# Altium schematic sheet CoproMKII_Ethernet.SchDoc
size B; SheetNumber: 4; SheetTotal: 4
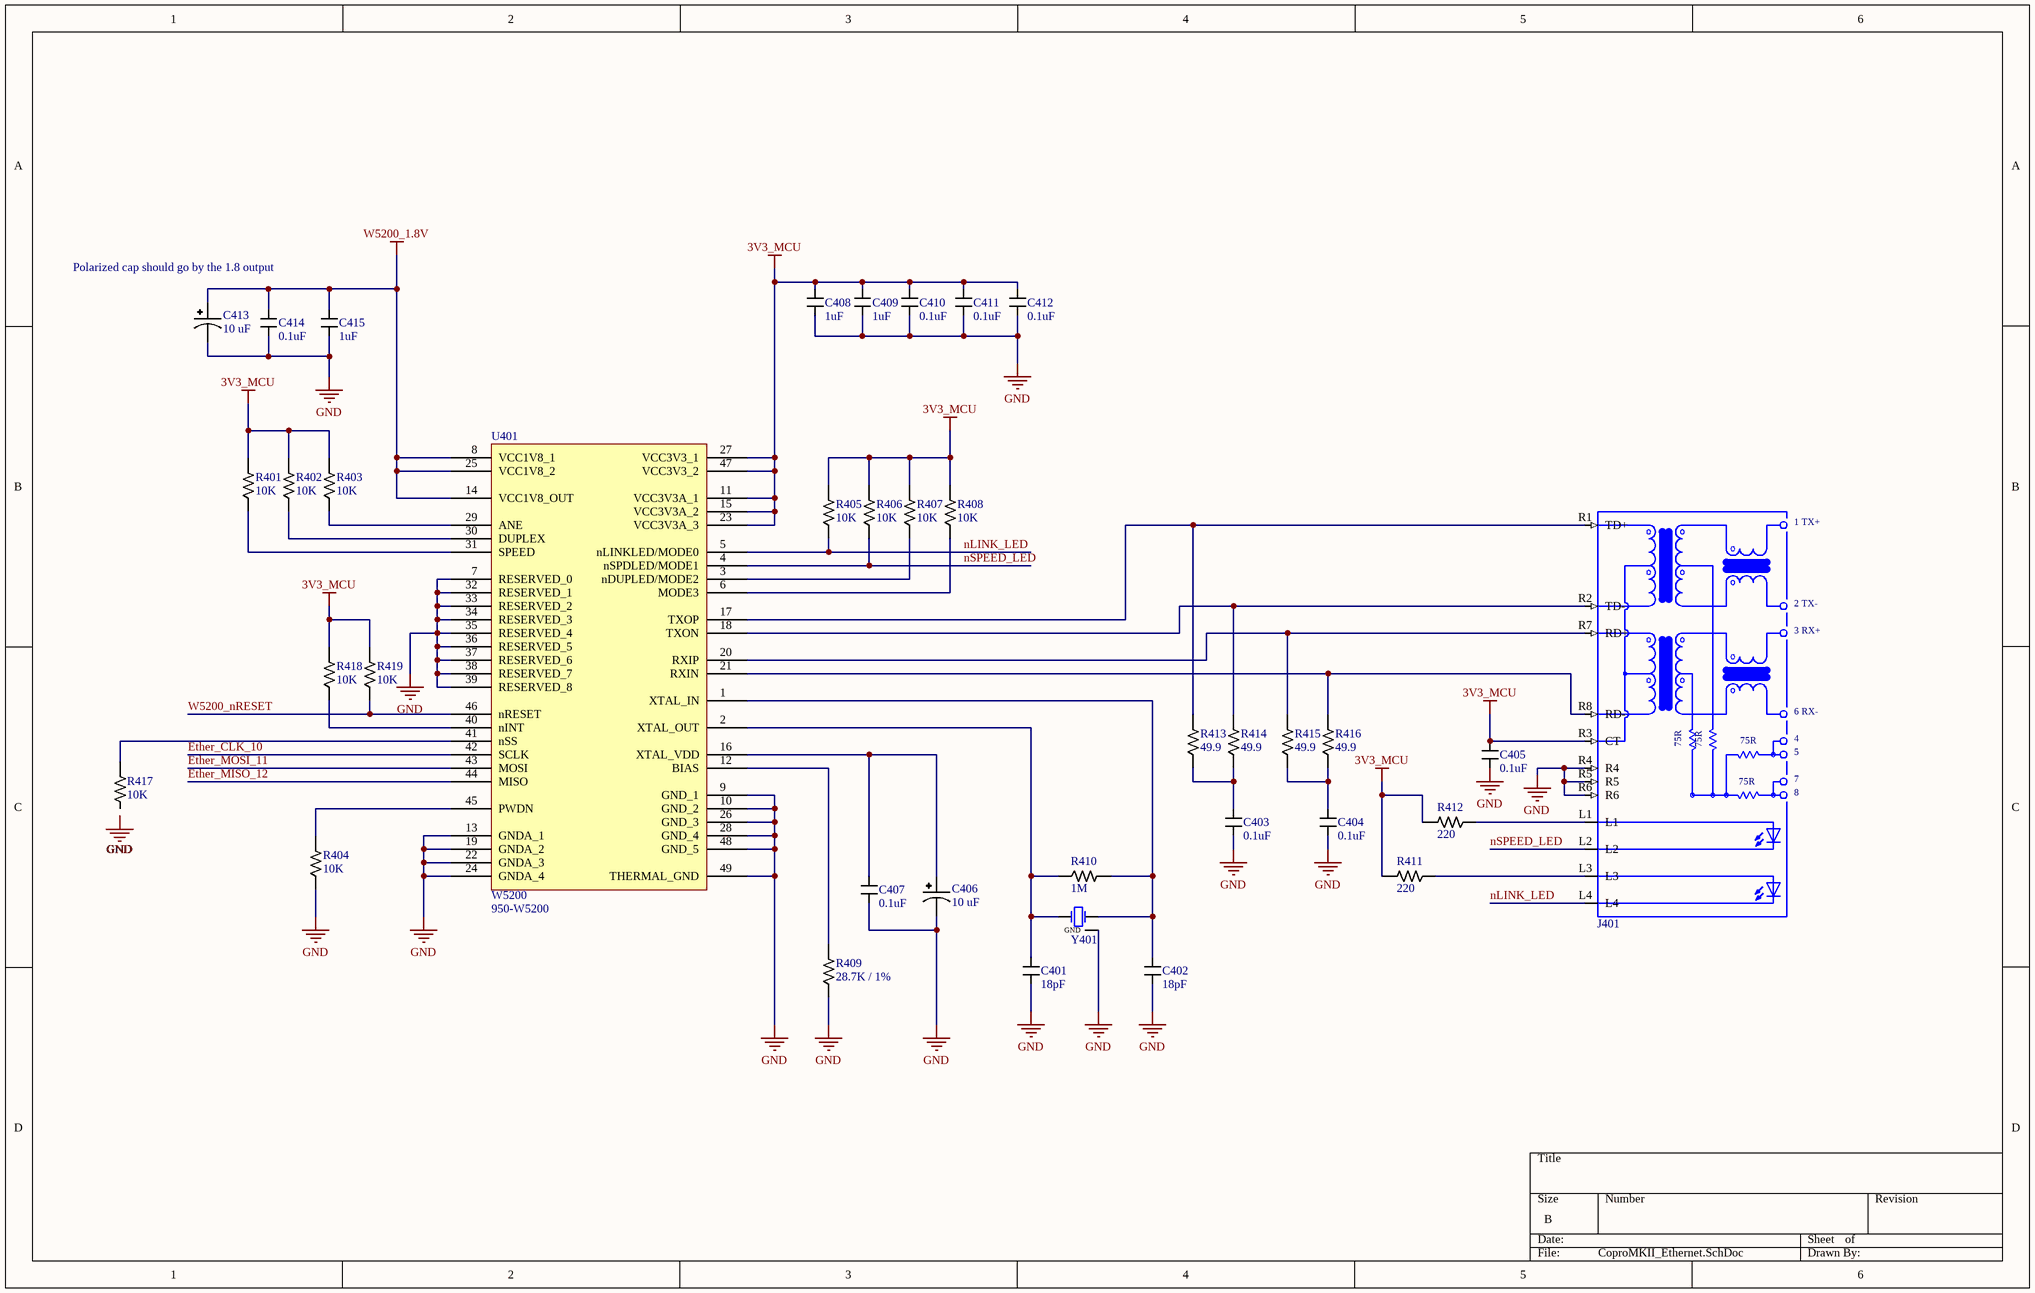
[diagram p0: CoproMKII_Ethernet.SchDoc]

## Parts
C401  value 18pF  [CAPACITOR_0603]  (hidden comment: 18pF Ceramic 50V)
C402  value 18pF  [CAPACITOR_0603]  (hidden comment: 18pF Ceramic 50V)
C403  value 0.1uF  [CAPACITOR_0603]  (hidden comment: 100nF Ceramic 6.3V)
C404  value 0.1uF  [CAPACITOR_0603]  (hidden comment: 100nF Ceramic 6.3V)
C405  value 0.1uF  [CAPACITOR_0603]  (hidden comment: 100nF Ceramic 6.3V)
C406  Value (uF): 10 uF  [CAPACITOR_0603]  (hidden comment: 10uF Tantalum 10V)
C407  value 0.1uF  [CAPACITOR_0603]  (hidden comment: 100nF Ceramic 6.3V)
C408  value 1uF  [CAPACITOR_0603]  (hidden comment: 1uF Ceramic 16V)
C409  value 1uF  [CAPACITOR_0603]  (hidden comment: 1uF Ceramic 16V)
C410  value 0.1uF  [CAPACITOR_0603]  (hidden comment: 100nF Ceramic 6.3V)
C411  value 0.1uF  [CAPACITOR_0603]  (hidden comment: 100nF Ceramic 6.3V)
C412  value 0.1uF  [CAPACITOR_0603]  (hidden comment: 100nF Ceramic 6.3V)
C413  Value (uF): 10 uF  [CAPACITOR_0603]  (hidden comment: 10uF Tantalum 10V)
C414  value 0.1uF  [CAPACITOR_0603]  (hidden comment: 100nF Ceramic 6.3V)
C415  value 1uF  [CAPACITOR_0603]  (hidden comment: 1uF Ceramic 16V)
J401  Ethernet Connector  [WIZNET_RB1-125BAG1A]  (value not drawn)
R401  Value  (Ohms): 10K  [RESISTOR_0603]  (hidden comment: 10k Ohm 5% 1/10W)
R402  Value  (Ohms): 10K  [RESISTOR_0603]  (hidden comment: 10k Ohm 5% 1/10W)
R403  Value  (Ohms): 10K  [RESISTOR_0603]  (hidden comment: 10k Ohm 5% 1/10W)
R404  Value  (Ohms): 10K  [RESISTOR_0603]  (hidden comment: 10k Ohm 5% 1/10W)
R405  Value  (Ohms): 10K  [RESISTOR_0603]  (hidden comment: 10k Ohm 5% 1/10W)
R406  Value  (Ohms): 10K  [RESISTOR_0603]  (hidden comment: 10k Ohm 5% 1/10W)
R407  Value  (Ohms): 10K  [RESISTOR_0603]  (hidden comment: 10k Ohm 5% 1/10W)
R408  Value  (Ohms): 10K  [RESISTOR_0603]  (hidden comment: 10k Ohm 5% 1/10W)
R409  Value  (Ohms): 28.7K / 1%  [RESISTOR_0603]  (hidden comment: K / 1%)
R410  1M  [RESISTOR_0603]
R411  Value  (Ohms): 220  [RESISTOR_0603]  (hidden comment: 220 Ohm 5% 1/8W)
R412  Value  (Ohms): 220  [RESISTOR_0603]  (hidden comment: 220 Ohm 5% 1/8W)
R413  Value  (Ohms): 49.9  [RESISTOR_0603]  (hidden comment: 49.9 Ohm 1% 1/8W)
R414  Value  (Ohms): 49.9  [RESISTOR_0603]  (hidden comment: 49.9 Ohm 1% 1/8W)
R415  Value  (Ohms): 49.9  [RESISTOR_0603]  (hidden comment: 49.9 Ohm 1% 1/8W)
R416  Value  (Ohms): 49.9  [RESISTOR_0603]  (hidden comment: 49.9 Ohm 1% 1/8W)
R417  Value  (Ohms): 10K  [RESISTOR_0603]  (hidden comment: 10k Ohm 5% 1/10W)
R418  Value  (Ohms): 10K  [RESISTOR_0603]  (hidden comment: 10k Ohm 5% 1/10W)
R419  Value  (Ohms): 10K  [RESISTOR_0603]  (hidden comment: 10k Ohm 5% 1/10W)
U401  W5200  Supplier Part Number 1: 950-W5200  [QFN-48]
Y401  CRYSTAL 12.0000MHZ 18PF SMD  [4-SMD No Lead Crystal]  (value not drawn)

## Nets
3V3_MCU: C405.1 C408.1 C409.1 C410.1 C411.1 C412.1 J401.R3(CT) R401.1 R402.1 R403.1 R405.1 R406.1 R407.1 R408.1 R411.1 R412.1 R418.1 R419.1 U401.11(VCC3V3A_1) U401.15(VCC3V3A_2) U401.23(VCC3V3A_3) U401.27(VCC3V3_1) U401.47(VCC3V3_2)
GND: C401.2 C402.2 C403.2 C404.2 C405.2 C406.2 C407.2 C408.2 C409.2 C410.2 C411.2 C412.2 C413.2 C414.2 C415.2 J401.R4 J401.R5 J401.R6 R404.2 R409.2 U401.7(RESERVED_0) U401.9(GND_1) U401.10(GND_2) U401.13(GNDA_1) U401.19(GNDA_2) U401.22(GNDA_3) U401.24(GNDA_4) U401.26(GND_3) U401.28(GND_4) U401.32(RESERVED_1) U401.33(RESERVED_2) U401.34(RESERVED_3) U401.35(RESERVED_4) U401.36(RESERVED_5) U401.37(RESERVED_6) U401.38(RESERVED_7) U401.39(RESERVED_8) U401.48(GND_5) U401.49(THERMAL_GND) Y401.GND
W5200_1.8V: C413.1 C414.1 C415.1 U401.8(VCC1V8_1) U401.14(VCC1V8_OUT) U401.25(VCC1V8_2)
Ether_CLK_10: U401.42(SCLK)
Ether_MISO_12: U401.44(MISO)
Ether_MOSI_11: U401.43(MOSI)
nLINK_LED: J401.L4 R405.2 U401.5(nLINKLED/MODE0)
nSPEED_LED: J401.L2 R406.2 U401.4(nSPDLED/MODE1)
W5200_nRESET: R419.2 U401.46(nRESET)
NetC401_1: C401.1 R410.2 U401.2(XTAL_OUT) Y401.1
NetC402_1: C402.1 R410.1 U401.1(XTAL_IN) Y401.2
NetC403_1: C403.1 R413.2 R414.2
NetC404_1: C404.1 R415.2 R416.2
NetC406_1: C406.1 C407.1 U401.16(XTAL_VDD)
NetJ401_L1: J401.L1 R412.2
NetJ401_L3: J401.L3 R411.2
NetJ401_R1: J401.R1(TD+) R413.1 U401.17(TXOP)
NetJ401_R2: J401.R2(TD-) R414.1 U401.18(TXON)
NetJ401_R7: J401.R7(RD+) R415.1 U401.20(RXIP)
NetJ401_R8: J401.R8(RD-) R416.1 U401.21(RXIN)
NetR401_2: R401.2 U401.31(SPEED)
NetR402_2: R402.2 U401.30(DUPLEX)
NetR403_2: R403.2 U401.29(ANE)
NetR404_1: R404.1 U401.45(PWDN)
NetR407_2: R407.2 U401.3(nDUPLED/MODE2)
NetR408_2: R408.2 U401.6(MODE3)
NetR409_1: R409.1 U401.12(BIAS)
NetR417_1: R417.1 U401.41(nSS)
NetR418_2: R418.2 U401.40(nINT)

Not connected (* = marked no-connect by the designer): R417 2

## Notes on the sheet
- Polarized cap should go by the 1.8 output
- (in symbol RB1-125BAG1A) 1 TX+; 2 TX-; 3 RX+; 6 RX-; 75R; 4; 5; 7; 8

## Library data of the parts
C401 C402 = CAPACITOR_0.000018uF_0603: Cap 18pF 50V +/-5% / Ceramic 0603; Made By: Flip B; ComponentLink1Description: Datsheet; ComponentLink1URL: https://www.mouser.com/datasheet/2/212/KEM_C1002_X7R_SMD-1102033.pdf; Tolerance: +/- 5%; Voltage: 50V; Supplier 1: Digi-Key; Supplier Part Number 1: 311-1061-1-ND
C403-C405 C407 C410-C412 C414 = CAPACITOR_0.1uF_0603: Cap 100nF 6.3V +/-10% / Ceramic 0603; Made By: Flip B; ComponentLink1Description: Datsheet; ComponentLink1URL: https://www.mouser.com/datasheet/2/212/KEM_C1002_X7R_SMD-1102033.pdf; Tolerance: +/- 10%; Voltage: 6.3V; Supplier 1: Digi-Key; Supplier Part Number 1: 399-15351-1-ND
C406 C413 = CAPACITOR_10uF_0603_Tantalum: Cap 10uF 10V +/-20% / Tantalum 0603; Made By: John S; ComponentLink1Description: Digikey; ComponentLink1URL: https://www.digikey.com/en/products/detail/kyocera-avx/F981A106MMA/4004990; Tolerance: +/- 20%; Voltage: 10V
C408 C409 C415 = CAPACITOR_1uF_0603: Cap 1uF 16V +/-10% / Ceramic 0603; Made By: Flip B; Tolerance: +/- 10%; Voltage: 16V; Supplier 1: Digi-Key; Supplier Part Number 1: 399-7847-1-ND
J401 = RB1-125BAG1A: CONN JACK 1PORT 100 BASE-T PCB
R401-R408 R417-R419 = RESISTOR_10K_0603: RES 10k OHM 5% 1/10W 0603; Tolerance: +/- 5%; Wattage: 1/8W; Made By: Robert Pafford; ComponentLink1Description: Datasheet; ComponentLink1URL: https://www.bourns.com/docs/product-datasheets/CRxxxxx.pdf; Supplier: Digikey; Digikey Part Numer: CR0603-JW-104ELFTR-ND; Supplier 1: Digi-Key; Supplier Part Number 1: 2019-RK73B1JTTD103JCT-ND
R409 = RESISTOR_28.7K / 1%_0603: RES 28.7K OHM 1% 1/8W 0603; Tolerance: +/- 5%; Made By: Robert Pafford; ComponentLink1Description: Datasheet; ComponentLink1URL: https://www.bourns.com/docs/product-datasheets/CRxxxxx.pdf; Wattage: 1/8W; Supplier: Digikey; Digikey Part Numer: CR0603-JW-104ELFTR-ND; Supplier 1: Digi-Key; Supplier Part Number 1: 541-28.7KHCT-ND
R410 = RESISTOR_1M_0603: RES 1M OHM 1/8W 0603; Tolerance: +/- 5%; Made By: Robert Pafford; ComponentLink1Description: Datasheet; ComponentLink1URL: https://www.bourns.com/docs/product-datasheets/CRxxxxx.pdf; Wattage: 1/8W; Supplier: Digikey; Digikey Part Numer: CR0603-JW-104ELFTR-ND; Supplier 1: Digi-Key; Supplier Part Number 1: RMCF0603JT1M00CT-ND; Value  (Ohms): 1M
R411 R412 = RESISTOR_200_0603: RES 220 OHM 5% 1/8W 0603; Tolerance: +/- 5%; Made By: John S; ComponentLink1Description: Digikey; ComponentLink1URL: https://www.digikey.com/en/products/detail/koa-speer-electronics-inc/RK73B1JTTD101J/9844701; Wattage: 1/8W; Supplier 1: Digi-Key; Supplier Part Number 1: 2019-RK73B1JTTD221JCT-ND
R413-R416 = RESISTOR_49.9_0603: RES 49.9 OHM 1% 1/8W 0603; Tolerance: +/- 1%; Made By: John S; ComponentLink1Description: Datasheet; ComponentLink1URL: https://www.bourns.com/docs/product-datasheets/CRxxxxx.pdf; Wattage: 1/8W; Supplier: Digikey; Supplier 1: Digi-Key; Supplier Part Number 1: RNCP0603FTD49R9CT-ND
U401 = W5200: WIZNET W5200 / 48QFN (7x7 mm); MF: Texas Instruments; MP: LM1117IMPX-3.3/NOPB; Created by:: Siddharth.V; Texas_Instruments-Purchase-URL: https://snapeda.com/shop?store=Texas+Instruments&id=410186; Price: None; Mouser-Purchase-URL: https://snapeda.com/shop?store=Mouser&id=410186; Value: *; Availability: Good; Package: SOT-223-4 Texas Instruments; Arrow_Electronics-Purchase-URL: https://snapeda.com/shop?store=Arrow+Electronics&id=410186; SnapEDA_Link: https://www.snapeda.com/parts/LM1117IMPX-3.3/NOPB/Texas%20Instruments/view-part/410186/?ref=snap; DigiKey-Purchase-URL: https://snapeda.com/shop?store=DigiKey&id=410186; ComponentLink1Description: Datasheet; ComponentLink1URL: https://www.wiznet.io/product-item/w5200/; Supplier 1: Mouser
Y401 = CRYSTAL_25MHz_SMD_1: 25 MHz ±20ppm Crystal 18pF; pin to pad: 2>3 GND>2+4; Made By: Robert Pafford; Frequency: 12 MHz; ESR: 50 Ohmz; Load Capacitance: 18pF; Supplier 1: Digi-Key; Supplier Part Number 1: 2151-AS-25.000-18-F-EXT-ND